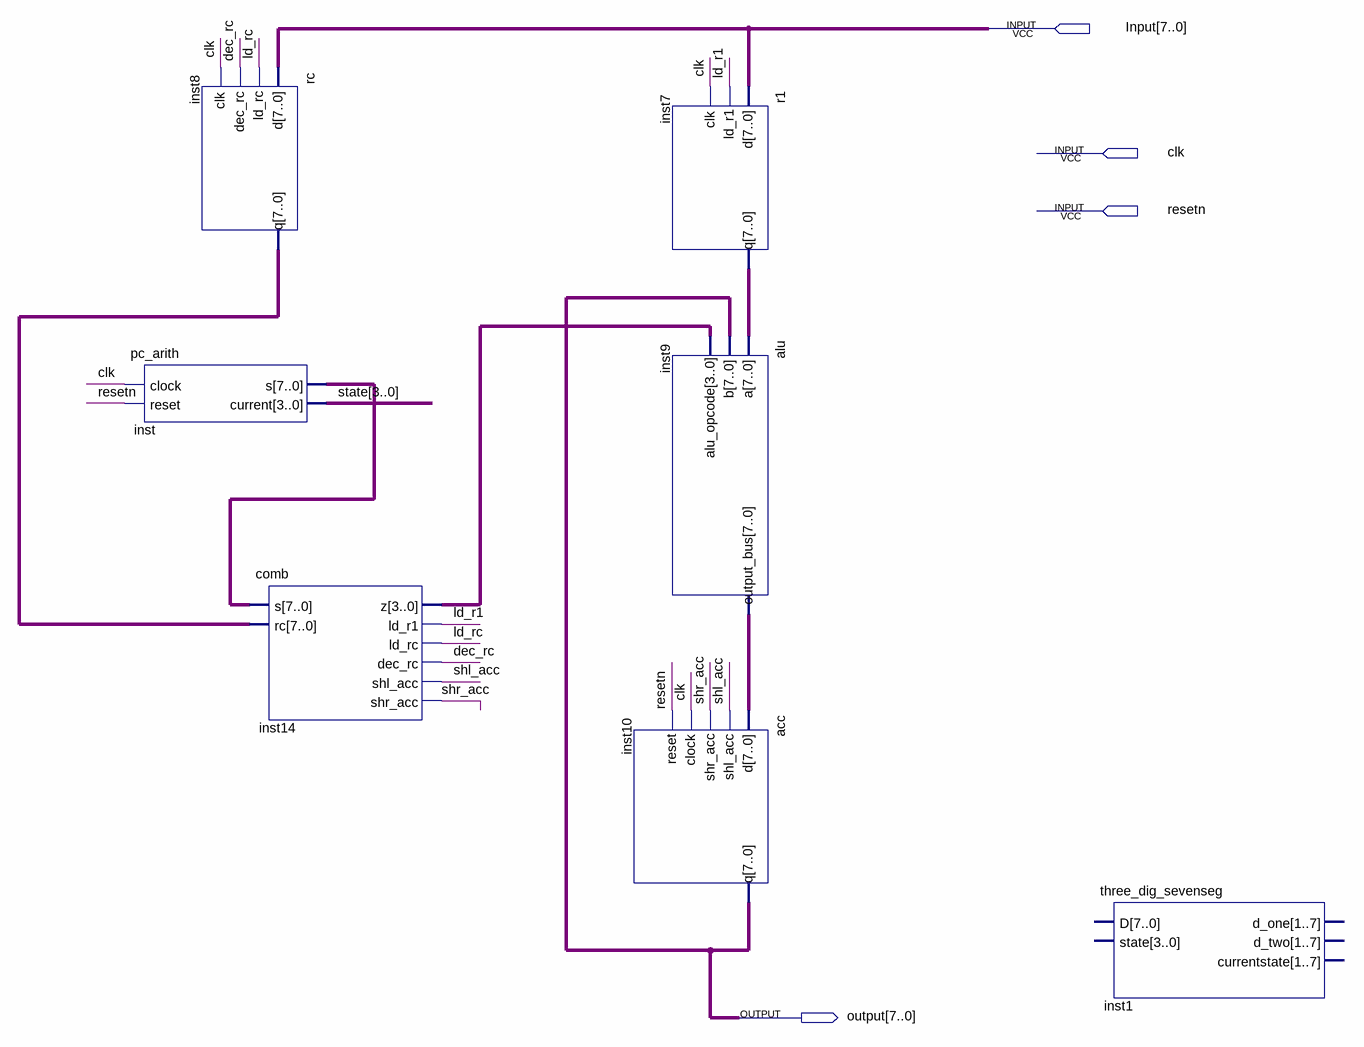
[diagram p0: schematic sheet]
// Quartus schematic lab_7.bdf as structural Verilog: 7 symbols, 4 pins
module lab_7 (
  input  [7:0] Input,
  input  clk,
  input  resetn,
  output [7:0] \output 
);

  wire dec_rc, ld_r1, ld_rc, shl_acc, shr_acc;
  wire [3:0] inst14_z, state;
  wire [7:0] inst7_q, inst8_q, inst9_output_bus, inst_s;

  pc_arith inst (.clock(clk), .reset(resetn), .s(inst_s), .current(state));
  rc inst8 (.d(Input), .ld_rc(ld_rc), .dec_rc(dec_rc), .clk(clk), .q(inst8_q));
  comb inst14 (
    .s(inst_s), .rc(inst8_q), .z(inst14_z), .ld_r1(ld_r1), .ld_rc(ld_rc), .dec_rc(dec_rc), .shl_acc(shl_acc),
    .shr_acc(shr_acc));
  r1 inst7 (.d(Input), .ld_r1(ld_r1), .clk(clk), .q(inst7_q));
  alu inst9 (.a(inst7_q), .b(\output ), .alu_opcode(inst14_z), .output_bus(inst9_output_bus));
  acc inst10 (.d(inst9_output_bus), .shl_acc(shl_acc), .shr_acc(shr_acc), .clock(clk), .reset(resetn), .q(\output ));
  three_dig_sevenseg inst1 ();  // open: D, state, d_one, d_two, currentstate
endmodule
